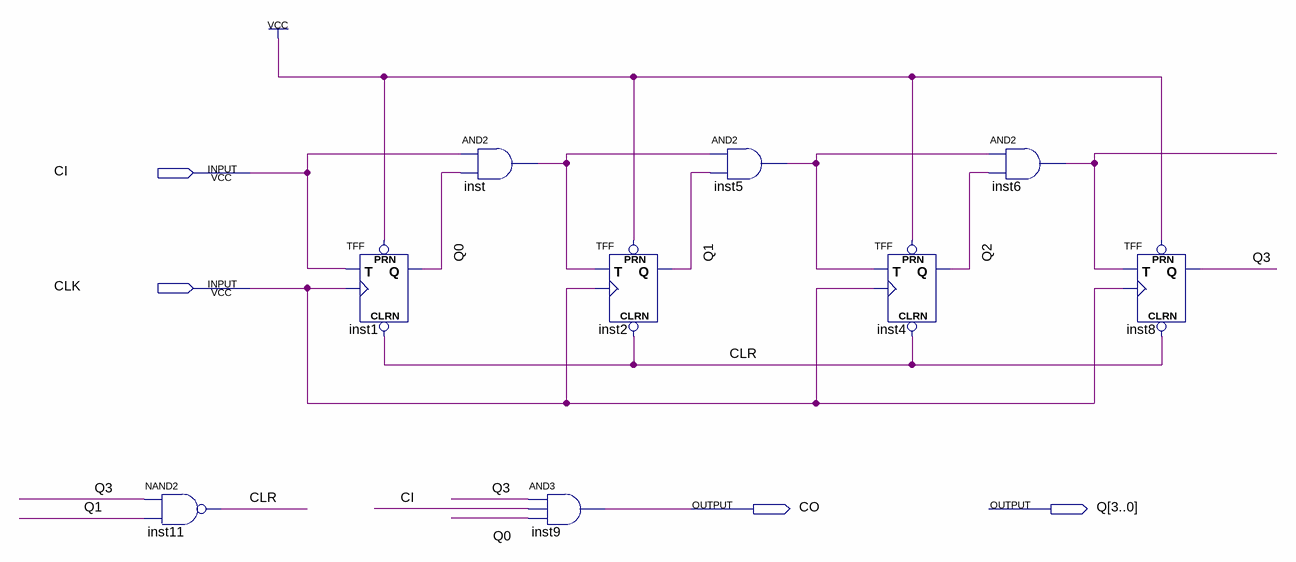
[diagram p0: schematic sheet]
// Quartus schematic cnt_m10.bdf as structural Verilog: 9 symbols, 4 pins
module cnt_m10 (
  input  CI,
  input  CLK,
  output CO,
  output [3:0] Q
);

  wire CLR, inst5_out, inst6_out, inst_out;

  nand inst11 (CLR, Q[3], Q[1]);
  TFF inst1 (.PRN(1'b1), .CLRN(CLR), .T(CI), .CLK(CLK), .Q(Q[0]));
  and inst (inst_out, CI, Q[0]);
  TFF inst2 (.PRN(1'b1), .CLRN(CLR), .T(inst_out), .CLK(CLK), .Q(Q[1]));
  and inst9 (CO, Q[3], CI, Q[0]);
  and inst5 (inst5_out, inst_out, Q[1]);
  TFF inst4 (.PRN(1'b1), .CLRN(CLR), .T(inst5_out), .CLK(CLK), .Q(Q[2]));
  and inst6 (inst6_out, inst5_out, Q[2]);
  TFF inst8 (.PRN(1'b1), .CLRN(CLR), .T(inst6_out), .CLK(CLK), .Q(Q[3]));
endmodule
